# Altium schematic sheet LD_driver.SchDoc
size 420 x 297 mm; Address1: Address1; Address2: Address2; Address3: Address3; Address4: Address4; DocumentNumber: *Э3; SheetNumber: 5; SheetTotal: 14; DocumentType: Схема электрическая *
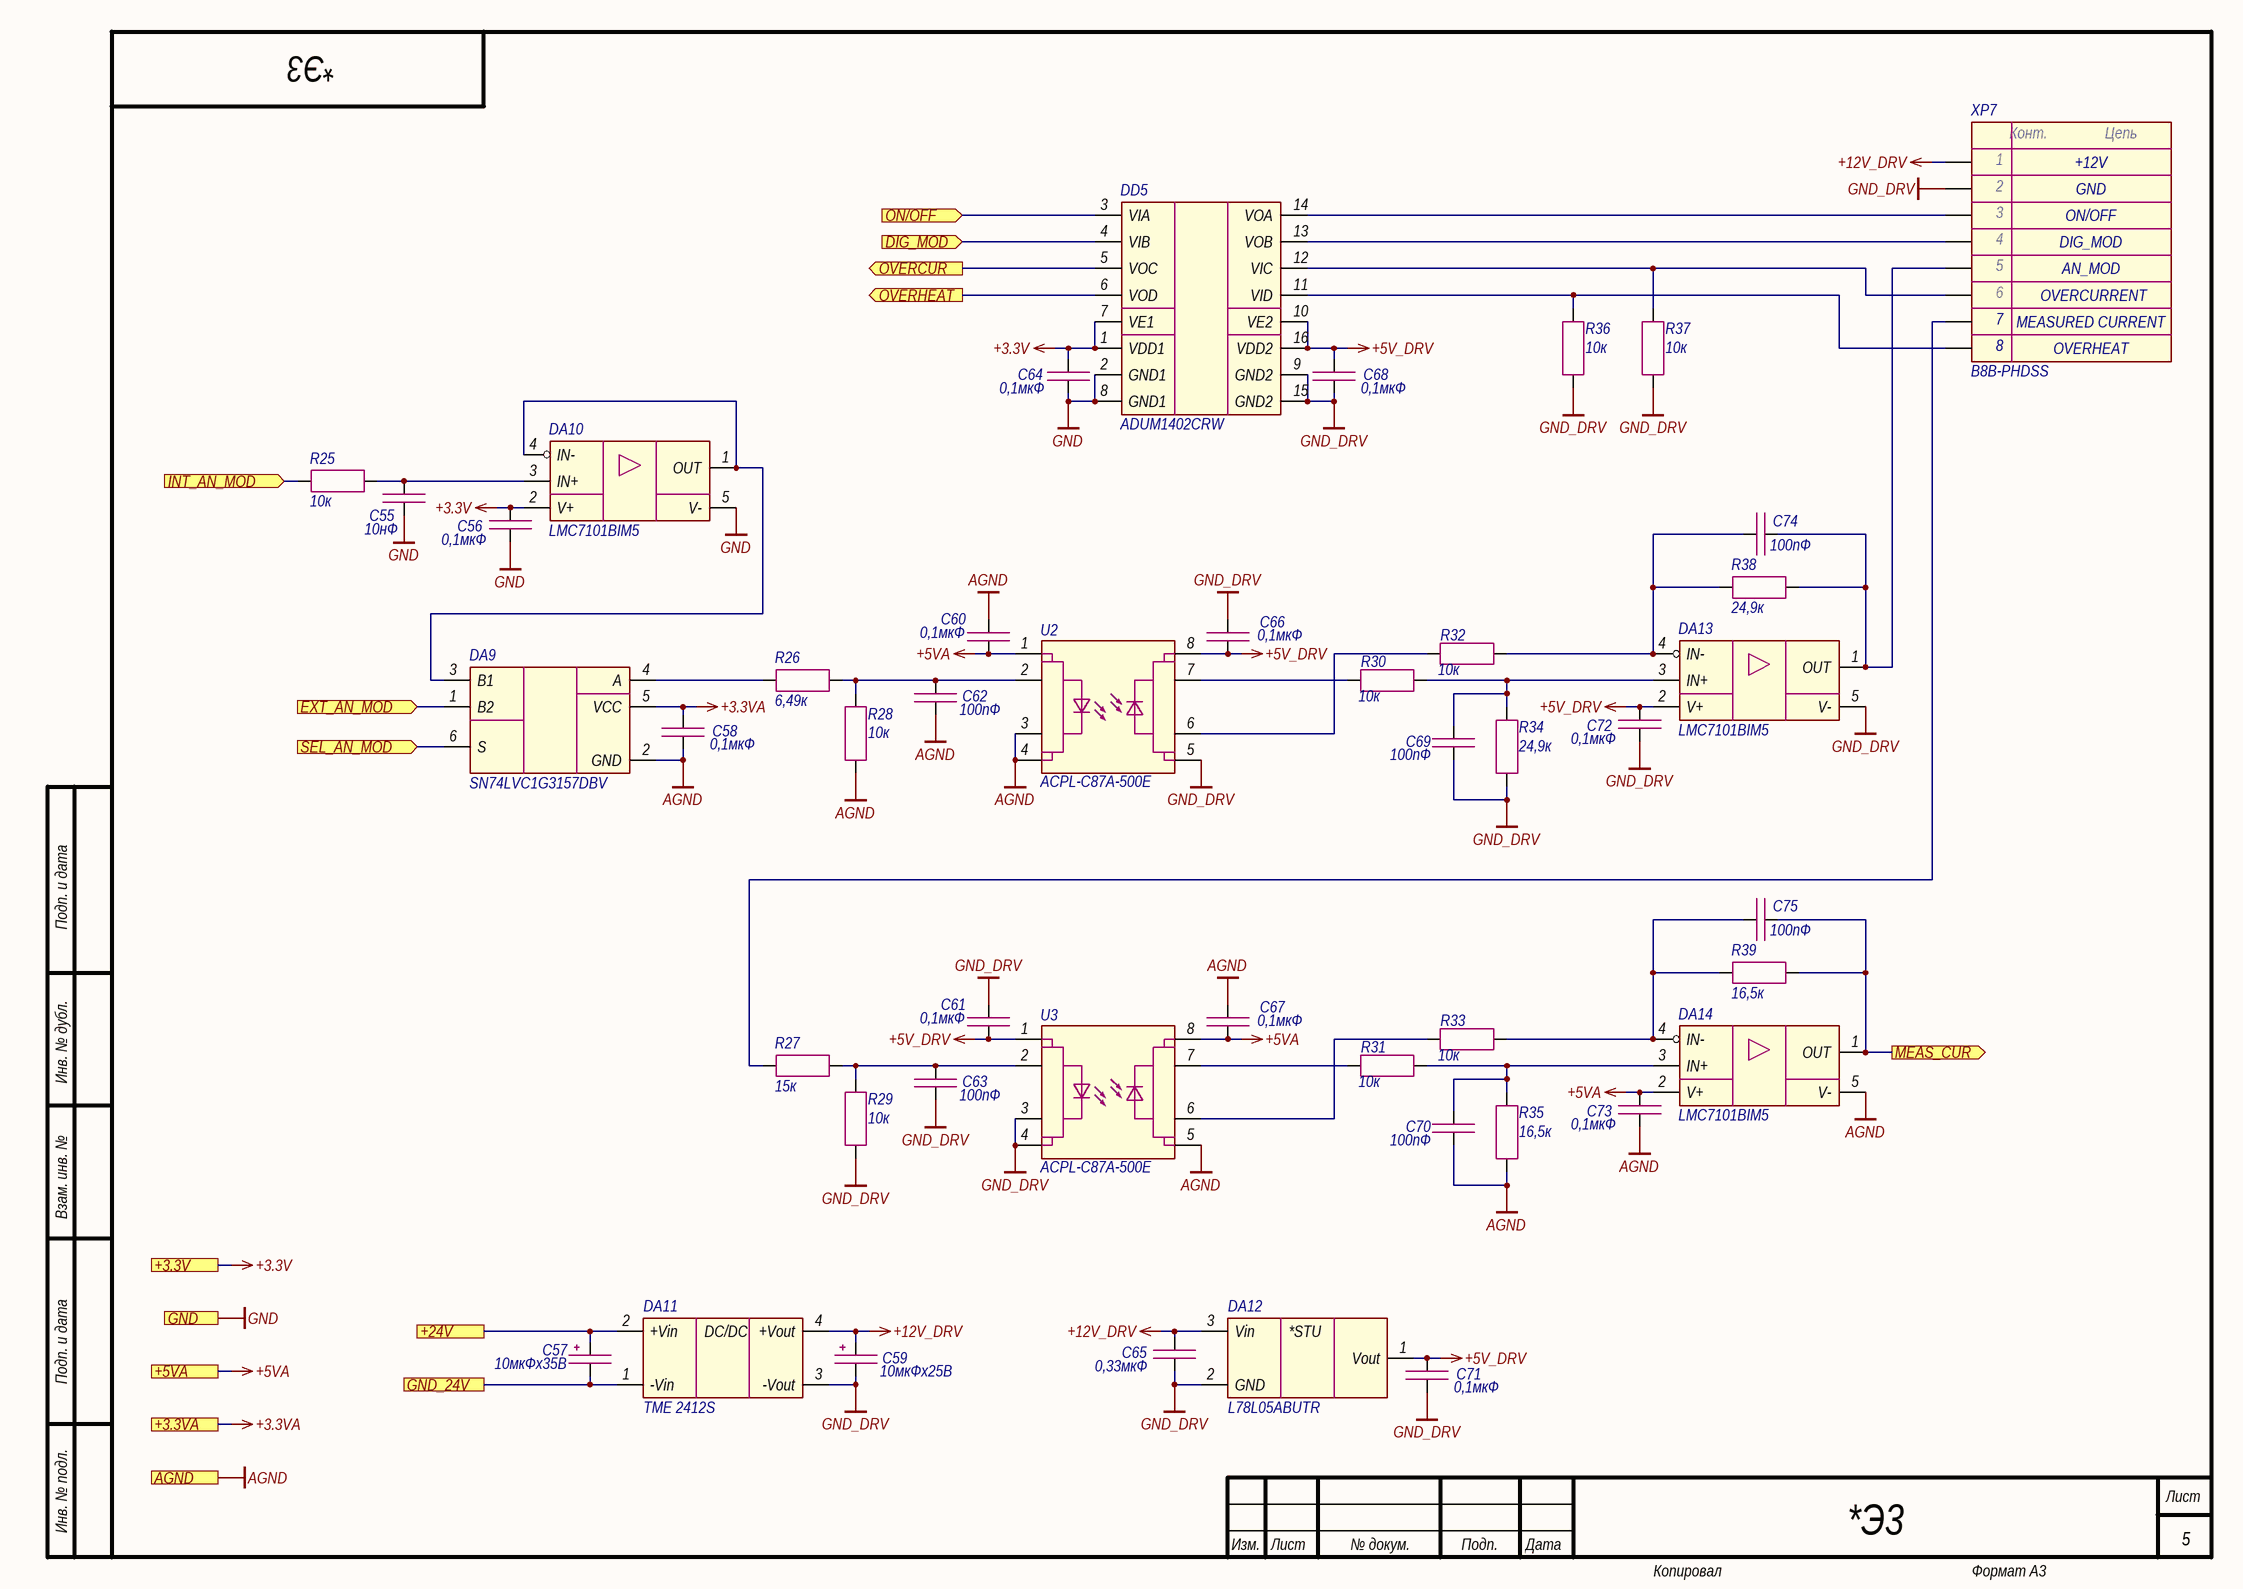
[diagram p0: LD_driver.SchDoc]

## Parts
C55  10нФ  [CAP_0603]
C56  0,1мкФ  [CAP_0603]
C57  10мкФх35B  [CAP_C]
C58  0,1мкФ  [CAP_0603]
C59  10мкФх25B  [CAP_C]
C60  0,1мкФ  [CAP_0603]
C61  0,1мкФ  [CAP_0603]
C62  100пФ  [CAP_0603]
C63  100пФ  [CAP_0603]
C64  0,1мкФ  [CAP_0603]
C65  0,33мкФ  [CAP_0805]
C66  0,1мкФ  [CAP_0603]
C67  0,1мкФ  [CAP_0603]
C68  0,1мкФ  [CAP_0603]
C69  100пФ  [CAP_0603]
C70  100пФ  [CAP_0603]
C71  0,1мкФ  [CAP_0603]
C72  0,1мкФ  [CAP_0603]
C73  0,1мкФ  [CAP_0603]
C74  100пФ  [CAP_0603]
C75  100пФ  [CAP_0603]
DA9  SN74LVC1G3157DBV  [SOT-23-6]
DA10  LMC7101BIM5  [SOT-23-5]
DA11  TME 2412S  [TME (SIP-4)]
DA12  L78L05ABUTR  [SOT-89]
DA13  LMC7101BIM5  [SOT-23-5]
DA14  LMC7101BIM5  [SOT-23-5]
DD5  ADUM1402CRW  [SOIC-16W]
R25  10к  [RES_0603]
R26  6,49к  [RES_0603]
R27  15к  [RES_0603]
R28  10к  [RES_0603]
R29  10к  [RES_0603]
R30  10к  [RES_0603]
R31  10к  [RES_0603]
R32  10к  [RES_0603]
R33  10к  [RES_0603]
R34  24,9к  [RES_0603]
R35  16,5к  [RES_0603]
R36  10к  [RES_0603]
R37  10к  [RES_0603]
R38  24,9к  [RES_0603]
R39  16,5к  [RES_0603]
U2  ACPL-C87A-500E  [SSO-8]
U3  ACPL-C87A-500E  [SSO-8]
XP7  B8B-PHDSS  [B8B-PHDSS]

## Ports
+3.3V (see Main[2D], Button[1D], Ethernet[3D], Fiber_interlock[2C], Flow_sensor[2C], Power_supply[2C], RS-485[2C]), +3.3VA (see Main[2D], Photodiode[1C], Thermistor[2C]), +5VA (see Main[2D], Analog_isolation[2C], Photodiode[1C]), +24V (see Main[1D], Button[1C], Column[1C], Flow_sensor[2C], Indication[1C]), AGND (see Main[2D], Analog_isolation[2C], Photodiode[1D], Thermistor[2C]), DIG_MOD (in, see Main[1C]), EXT_AN_MOD (in, see Main[1D]), GND (see Main[2D], Button[1D], Column[1C], Ethernet[3D], Fiber_interlock[2C], Flow_sensor[2C], Guide_laser[1C], Indication[1C], Power_supply[2C], RS-485[2C]), GND_24V (see Main[1D], Button[1D], Column[1C], Flow_sensor[2C], Indication[1C]), INT_AN_MOD (in, see Main[1C]), MEAS_CUR (out, see Main[2C]), ON/OFF (in, see Main[1C]), OVERCUR (out, see Main[2C]), OVERHEAT (out, see Main[2C]), SEL_AN_MOD (in, see Main[1D])

## Nets
+3.3V: C56.1 C64.1 DA10.2(V+) DD5.1(VDD1) DD5.7(VE1) ; port +3.3V
+3.3VA: C58.1 DA9.5(VCC) ; port +3.3VA
+5V_DRV: C61.1 C66.1 C68.1 C71.1 C72.1 DA12.1(Vout) DA13.2(V+) DD5.10(VE2) DD5.16(VDD2) U2.8(VDD2) U3.1(VDD1)
+5VA: C60.1 C67.1 C73.1 DA14.2(V+) U2.1(VDD1) U3.8(VDD2) ; port +5VA
+12V_DRV: C59.1 C65.2 DA11.4(+Vout) DA12.3(Vin) XP7.1
AGND: C58.2 C60.2 C62.1 C67.2 C70.2 C73.2 DA9.2(GND) DA14.5(V-) R28.2 R35.2 U2.3(SHDN) U2.4(GND1) U3.5(GND2) ; port AGND
GND: C55.2 C56.2 C64.2 DA10.5(V-) DD5.2(GND1) DD5.8(GND1) ; port GND
GND_DRV: C59.2 C61.2 C63.1 C65.1 C66.2 C68.2 C69.2 C71.2 C72.2 DA11.3(-Vout) DA12.2(GND) DA13.5(V-) DD5.9(GND2) DD5.15(GND2) R29.2 R34.1 R36.2 R37.2 U2.5(GND2) U3.3(SHDN) U3.4(GND1) XP7.2
+24V: C57.1 DA11.2(+Vin) ; port +24V
DIG_MOD: DD5.4(VIB) ; port DIG_MOD
EXT_AN_MOD: DA9.1(B2) ; port EXT_AN_MOD
GND_24V: C57.2 DA11.1(-Vin) ; port GND_24V
INT_AN_MOD: R25.1 ; port INT_AN_MOD
MEAS_CUR: C75.2 DA14.1(OUT) R39.1 ; port MEAS_CUR
ON/OFF: DD5.3(VIA) ; port ON/OFF
OVERCUR: DD5.5(VOC) ; port OVERCUR
OVERHEAT: DD5.6(VOD) ; port OVERHEAT
SEL_AN_MOD: DA9.6(S) ; port SEL_AN_MOD
NetC55_1: C55.1 DA10.3(IN+) R25.2
NetC62_2: C62.2 R26.1 R28.1 U2.2(VIN)
NetC63_2: C63.2 R27.1 R29.1 U3.2(VIN)
NetC69_1: C69.1 DA13.3(IN+) R30.2 R34.2
NetC70_1: C70.1 DA14.3(IN+) R31.2 R35.1
NetC74_1: C74.1 DA13.4(IN-) R32.2 R38.1
NetC74_2: C74.2 DA13.1(OUT) R38.2 XP7.5
NetC75_1: C75.1 DA14.4(IN-) R33.2 R39.2
NetDA9_3: DA9.3(B1) DA10.1(OUT) DA10.4(IN-)
NetDA9_4: DA9.4(A) R26.2
NetDD5_11: DD5.11(VID) R36.1 XP7.8
NetDD5_12: DD5.12(VIC) R37.1 XP7.6
NetDD5_13: DD5.13(VOB) XP7.4
NetDD5_14: DD5.14(VOA) XP7.3
NetR27_2: R27.2 XP7.7
NetR30_1: R30.1 U2.7(VOUT+)
NetR31_1: R31.1 U3.7(VOUT+)
NetR32_1: R32.1 U2.6(VOUT-)
NetR33_1: R33.1 U3.6(VOUT-)

## Notes on the sheet
- +12V
- GND
- ON/OFF
- DIG_MOD
- (near XP7) MEASURED CURRENT
- AN_MOD
- OVERCURRENT
- OVERHEAT
- Подп. и дата
- Инв. № дубл.
- Взам. инв. №
- Инв. № подл.
- Изм.
- Лист
- № докум.
- Подп.
- Дата
- Копировал
- Формат А3
- (in symbol Connector-8) Конт.; Цепь
- (in symbol LD2981ABU50TR) *STU
- (in symbol TME) DC/DC

## Library data of the parts
C55 = Capacitor: Manufacturer: Murata; Model: GRM188R71H103JA01D; Value: 10нФ; Document: *
C56 C58 C60 C61 C64 C66-C68 C71-C73 = Capacitor: Manufacturer: Murata; Model: GRM188R71H104KA93D; Value: 0,1мкФ; Document: *
C57 = Capacitor_Polar: Model: TECAP, 10 мкФ, 35 В, тип C, 10%; Value: 10мкФх35B; Document: *; Manufacturer: *
C59 = Capacitor_Polar: Model: TECAP, 10 мкФ, 25 В, тип B, 10%; Value: 10мкФх25B; Document: *; Manufacturer: *
C62 C63 C69 C70 C74 C75 = Capacitor: Manufacturer: Murata; Model: GRM1885C1H101JA01D; Value: 100пФ; Document: *
C65 = Capacitor: Manufacturer: Murata; Model: GRM219R71H334KA88D; Value: 0,33мкФ; Document: *
DA9 = SN74LVC1G3157: Manufacturer: Texas Instruments; Model: SN74LVC1G3157DBV; Document: *
DA10 DA13 DA14 = LMC7101: Manufacturer: Texas Instruments; Model: LMC7101BIM5; Document: *
DA11 = TME: Manufacturer: Traco Power; Model: TME 2412S; Document: *
DA12 = LD2981ABU50TR: Manufacturer: STMicroelectronics; Model: L78L05ABUTR; Document: *
DD5 = ADUM1402: Manufacturer: Analog Devices; Model: ADUM1402CRW; Document: *
R25 R28-R33 R36 R37 = Resistor: Manufacturer: Yageo; Model: RC0603FR-0710KL; Value: 10к; Document: *
R26 = Resistor: Manufacturer: Yageo; Model: RC0603FR-076K49L; Value: 6,49к; Document: *
R27 = Resistor: Manufacturer: Yageo; Model: RC0603FR-0715KL; Value: 15к; Document: *
R34 R38 = Resistor: Manufacturer: Yageo; Model: RC0603FR-0724K9L; Value: 24,9к; Document: *
R35 R39 = Resistor: Manufacturer: Yageo; Model: RC0603FR-0716K5L; Value: 16,5к; Document: *
U2 U3 = ACPL-C87: Manufacturer: Broadcom; Model: ACPL-C87A-500E
XP7 = Connector-8: Manufacturer: JST; Model: B8B-PHDSS; Document: *